# EasyEDA schematic SCH_Smartlock-V3_2024-05-26.json
TITLE: Smartlock ESP8266; REV: 2.0; Date: 2023-03-27; Sheet: 1/1; Drawn By: peter.rakolcza; Company: Peter Rakolcza
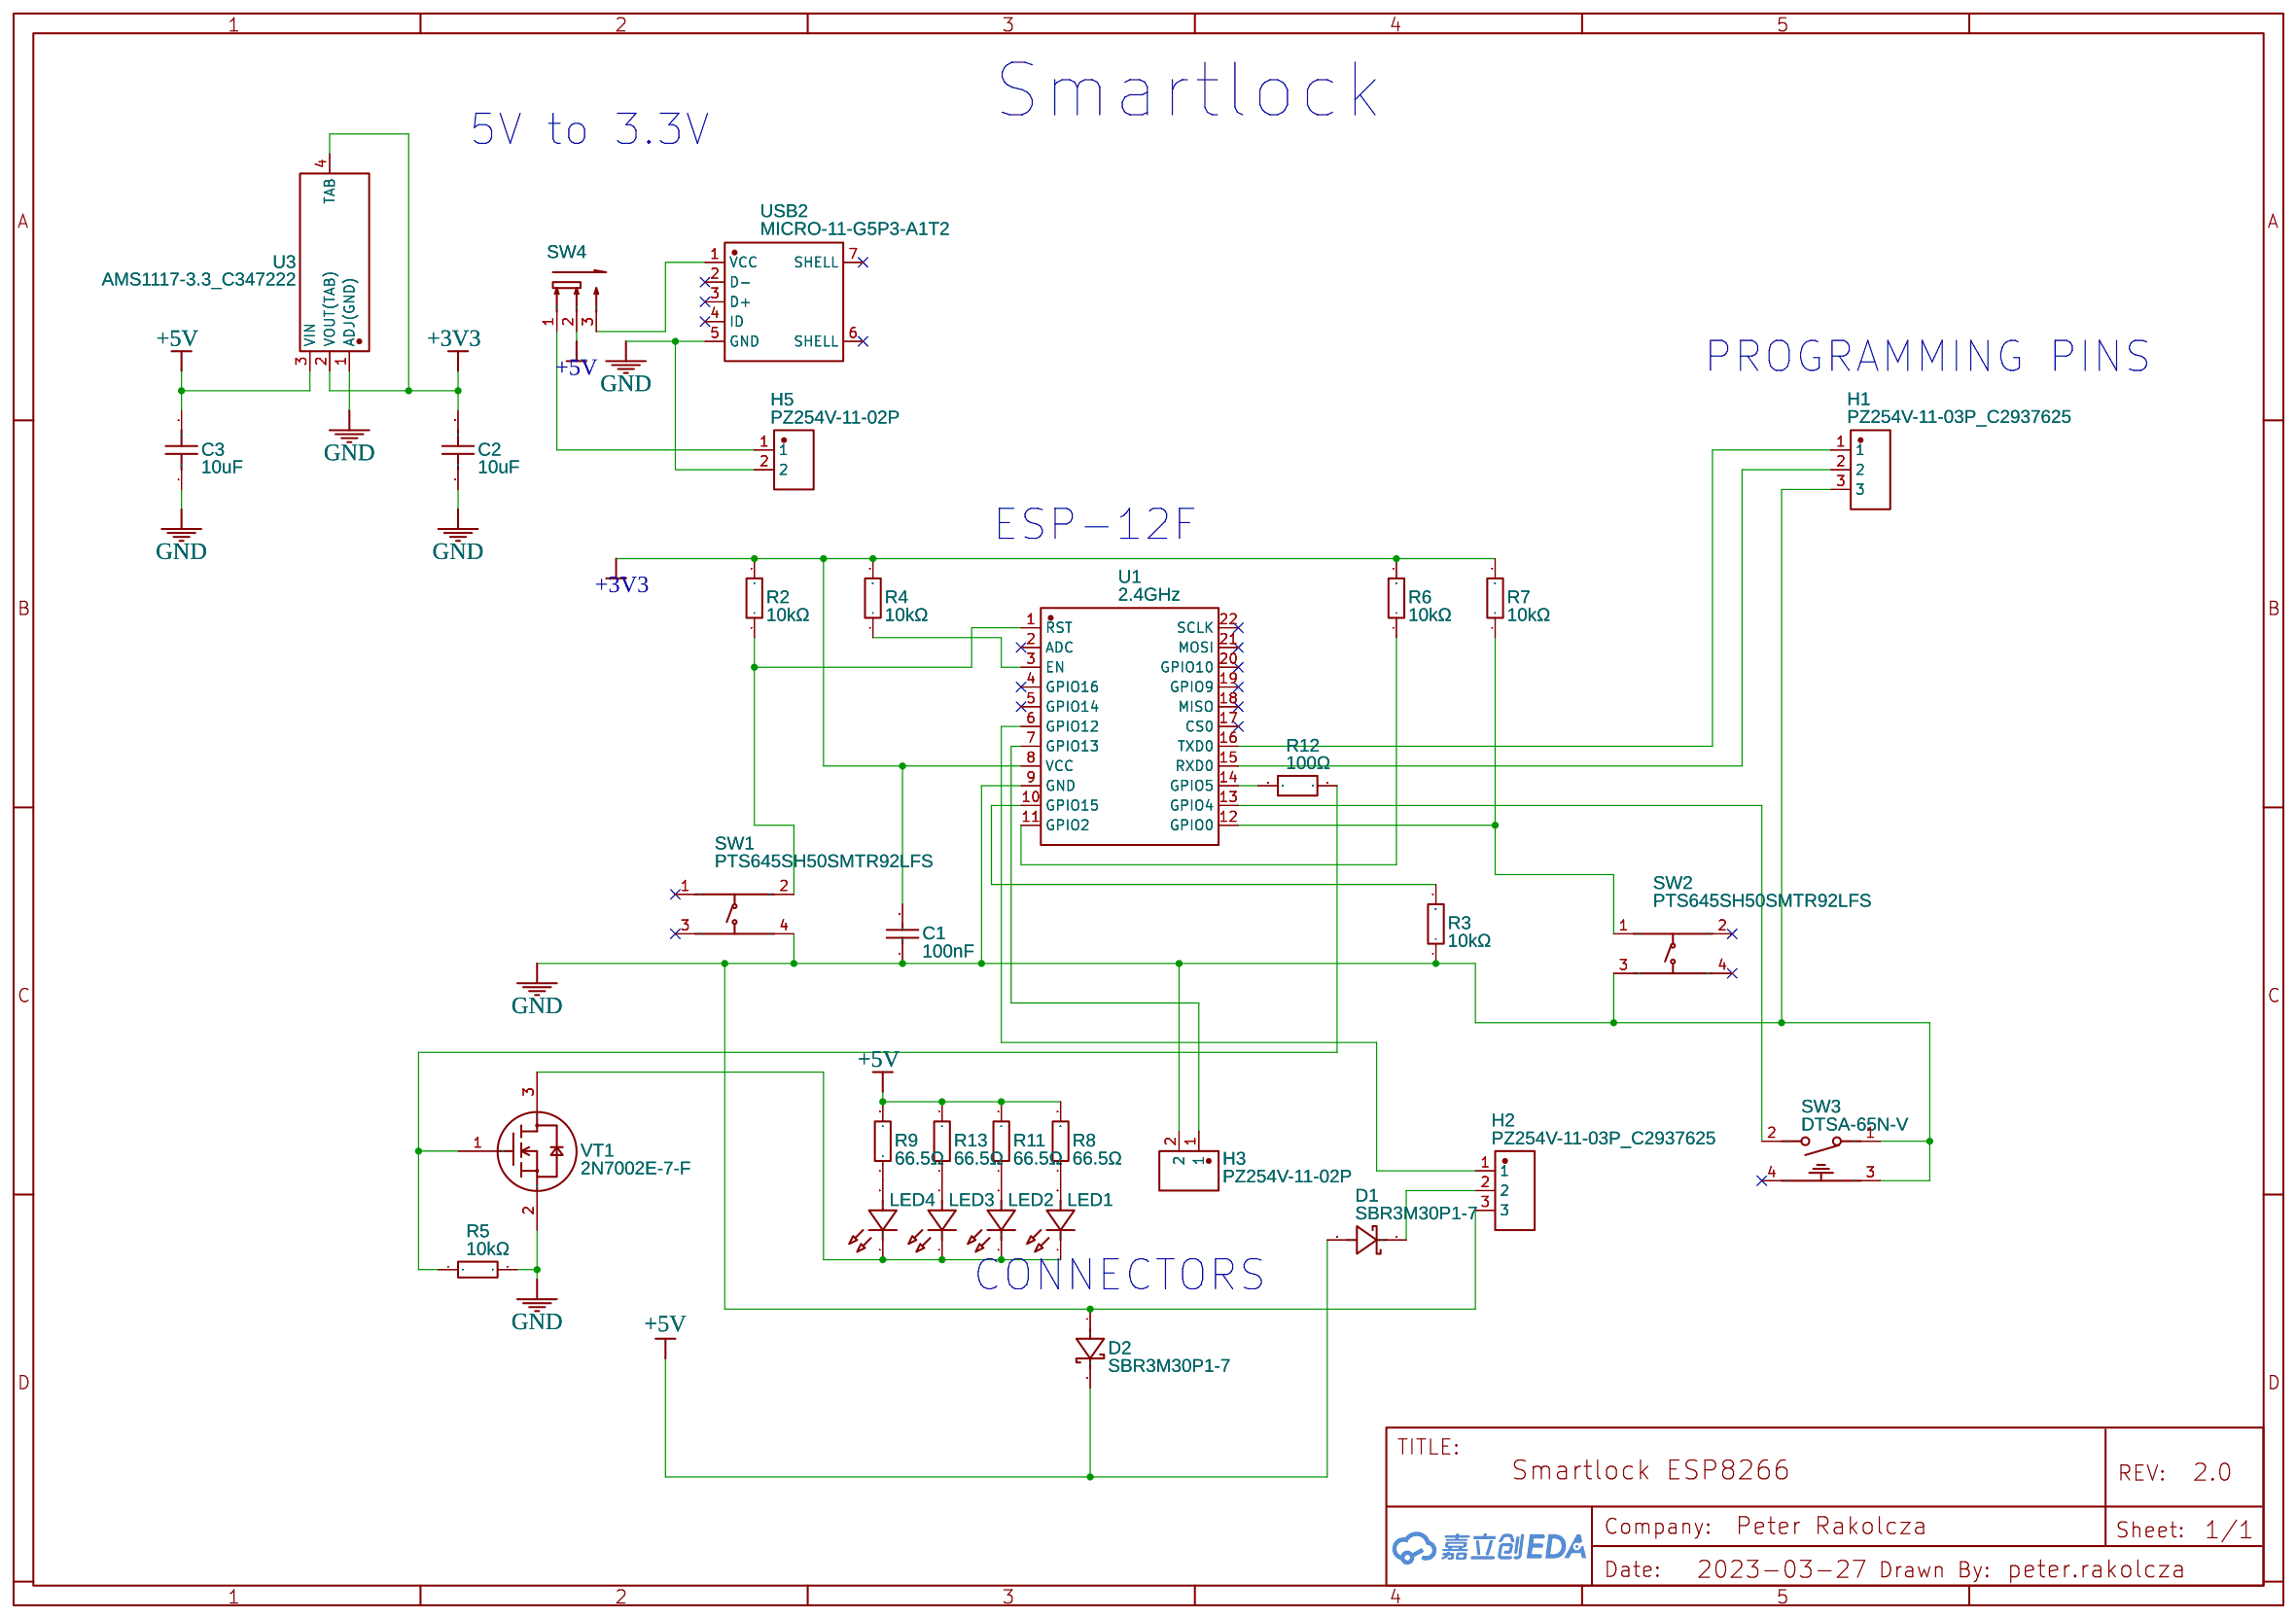
[diagram p0: schematic sheet]

## Parts
C1  100nF  [C0402_NEW]
C2  10uF  [C0402]
C3  10uF  [C0402]
D1  SBR3M30P1-7  [POWERDI123_L2.8-W1.8-LS3.7-RD]
D2  SBR3M30P1-7  [POWERDI123_L2.8-W1.8-LS3.7-RD]
H1  PZ254V-11-03P_C2937625  [HDR-TH_3P-P2.54-V-M]
H2  PZ254V-11-03P_C2937625  [HDR-TH_3P-P2.54-V-M]
H3  PZ254V-11-02P  [HDR-TH_2P-P2.54-V-M]
H5  PZ254V-11-02P  [HDR-TH_2P-P2.54-V-M]
LED1  TZ-P2-0805WYCS2-0.8T  [LED0805-RD_WHITE]
LED2  TZ-P2-0805WYCS2-0.8T  [LED0805-RD_WHITE]
LED3  TZ-P2-0805WYCS2-0.8T  [LED0805-RD_WHITE]
LED4  TZ-P2-0805WYCS2-0.8T  [LED0805-RD_WHITE]
R2  10kΩ  [R0805]
R3  10kΩ  [R0805]
R4  10kΩ  [R0805]
R5  10kΩ  [R0805]
R6  10kΩ  [R0805]
R7  10kΩ  [R0805]
R8  66.5Ω  [R0805]
R9  66.5Ω  [R0805]
R11  66.5Ω  [R0805]
R12  100Ω  [R0805]
R13  66.5Ω  [R0805]
SW1  PTS645SH50SMTR92LFS  [KEY-SMD_4P-L6.0-W6.0-P4.50-LS9.0]
SW2  PTS645SH50SMTR92LFS  [KEY-SMD_4P-L6.0-W6.0-P4.50-LS9.0]
SW3  DTSA-65N-V  [SW-TH_DTSA-65N-V]
SW4  MST-22D18G2 3J_C2875122  [SW-SMD_SHOUHAN_MST-22D18G23J_C2875122]
U1  2.4GHz  [WIFIM-SMD_ESP-12F-ESP8266MOD]
U3  AMS1117-3.3_C347222  [SOT-223-4_L6.5-W3.5-P2.30-LS7.0-BR]
USB2  MICRO-11-G5P3-A1T2  [MICRO-USB-SMD_MICRO-12-G2P3-A1T2]
VT1  2N7002E-7-F  [SOT-23_L2.9-W1.3-P1.90-LS2.4-BR]

## Library data of the parts
C1 = CL05B104KO5NNNC: Supplier: LCSC; Manufacturer: SAMSUNG(三星); Supplier Part: C1525; JLCPCB Part Class: Basic Part
C2 C3 = CL05A106MP5NUNC_C315248: Supplier: LCSC; Supplier Part: C315248; Manufacturer: Samsung Electro-Mechanics; Manufacturer Part: CL05A106MP5NUNC; Contributor: LCSC; JLCPCB Part Class: Extended Part
D1 D2 = SBR3M30P1-7: Supplier: LCSC; Supplier Part: C460953; Manufacturer: DIODES(美台); Contributor: lcsc; JLCPCB Part Class: Extended Part
H1 H2 = PZ254V-11-03P_C2937625: Supplier: LCSC; Supplier Part: C2937625; Manufacturer: XFCN(兴飞); Manufacturer Part: PZ254V-11-03P; Contributor: LCSC; JLCPCB Part Class: Extended Part
H3 H5 = PZ254V-11-02P: Supplier: LCSC; Supplier Part: C492401; Manufacturer: XFCN(兴飞); Contributor: LCSC; JLCPCB Part Class: Extended Part
LED1-LED4 = TZ-P2-0805WYCS2-0.8T: Contributor: LCSC; Supplier: LCSC; Supplier Part: C779456; Manufacturer: TUOZHAN(拓展光电); JLCPCB Part Class: Extended Part
R2-R4 R6 R7 = 0805W8F1002T5E: Supplier: LCSC; Manufacturer: UNI-ROYAL(厚声); Supplier Part: C17414; Resistance (Ohms): 10K; JLCPCB Part Class: Basic Part
R5 = RC0805FR-0710KL: Supplier: LCSC; Manufacturer: YAGEO(国巨); Supplier Part: C84376; JLCPCB Part Class: Extended Part
R8 R9 R11 R13 = RS-05K66R5FT: Contributor: LCSC; Supplier: LCSC; Supplier Part: C322549; Manufacturer: FH(风华); JLCPCB Part Class: Extended Part
R12 = CRCW0805100RJNEAC: Supplier: LCSC; Supplier Part: C3008930; Manufacturer: VISHAY(威世); JLCPCB Part Class: Extended Part; Contributor: lcsc
SW1 SW2 = PTS645SH50SMTR92LFS: Supplier: LCSC; Supplier Part: C221869; Manufacturer: C&K; Contributor: LCSC; JLCPCB Part Class: Extended Part
SW3 = DTSA-65N-V: Supplier: LCSC; Supplier Part: C224975; Manufacturer: 圜达; Contributor: LCSC; JLCPCB Part Class: Extended Part
SW4 = MST-22D18G2 3J_C2875122: Contributor: LCSC; Supplier: LCSC; Supplier Part: C2875122; Manufacturer: SHOU HAN(首韩); Manufacturer Part: MST-22D18G2 3J; JLCPCB Part Class: Extended Part
U1 = ESP-12F(ESP8266MOD): Supplier: LCSC; Manufacturer: Ai-Thinker(安信可); Supplier Part: C82891; JLCPCB Part Class: Extended Part
U3 = AMS1117-3.3_C347222: Supplier: LCSC; Supplier Part: C347222; Manufacturer: Youtai Semiconductor Co., Ltd.; Manufacturer Part: AMS1117-3.3; Contributor: LCSC; JLCPCB Part Class: Extended Part
USB2 = MICRO-11-G5P3-A1T2: Supplier: LCSC; Supplier Part: C2874592; Manufacturer: Yuandi(台湾元迪); Contributor: LCSC; JLCPCB Part Class: Extended Part
VT1 = 2N7002E-7-F: Contributor: LCSC; Supplier: LCSC; Manufacturer: DIODES(美台); Supplier Part: C151383; JLCPCB Part Class: Extended Part

## Nets
+3V3: C1.2 C2.2 R2.2 R4.2 R6.2 R7.2 U1.8(VCC) U3.2(VOUT(TAB)) U3.4(TAB)
+5V: C3.2 D1.1(A) D2.2(K) R8.2 R9.2 R11.2 R13.2 SW4.2 U3.3(VIN)
GND: C1.1 C2.1 C3.1 D2.1(A) H1.3 H2.3 H3.2 H5.2 R3.1 R5.2 SW1.4 SW2.3 SW3.1 SW3.3 U1.9(GND) U3.1(ADJ(GND)) USB2.5(GND) VT1.2(S)
Net-(D1-2): D1.2(K) H2.2
Net-(H1-1): H1.1 U1.16(TXD0)
Net-(H1-2): H1.2 U1.15(RXD0)
Net-(H2-1): H2.1 U1.6(GPIO12)
Net-(H3-1): H3.1 U1.7(GPIO13)
Net-(H5-1): H5.1 SW4.1
Net-(LED1-1): LED1.1(K) LED2.1(K) LED3.1(K) LED4.1(K) VT1.3(D)
Net-(LED1-2): LED1.2(A) R8.1
Net-(LED2-2): LED2.2(A) R11.1
Net-(LED3-2): LED3.2(A) R13.1
Net-(LED4-2): LED4.2(A) R9.1
Net-(R2-1): R2.1 SW1.2 U1.1(RST)
Net-(R3-2): R3.2 U1.10(GPIO15)
Net-(R4-1): R4.1 U1.3(EN)
Net-(R5-1): R5.1 R12.2 VT1.1(G)
Net-(R6-1): R6.1 U1.11(GPIO2)
Net-(R7-1): R7.1 SW2.1 U1.12(GPIO0)
Net-(R12-1): R12.1 U1.14(GPIO5)
Net-(SW3-2): SW3.2 U1.13(GPIO4)
Net-(SW4-3): SW4.3 USB2.1(VCC)

Not connected (* = marked no-connect by the designer): SW1 1* 3*; SW2 2* 4*; SW3 4*; U1 2(ADC)* 4(GPIO16)* 5(GPIO14)* 17(CS0)* 18(MISO)* 19(GPIO9)* 20(GPIO10)* 21(MOSI)* 22(SCLK)*; USB2 2(D-)* 3(D+)* 4(ID)* 6(SHELL)* 7(SHELL)*

## Notes on the sheet
- Smartlock
- 5V to 3.3V
- PROGRAMMING PINS
- ESP-12F
- CONNECTORS
